# Altium schematic sheet Sheet2.SchDoc
size A4; SheetNumber: 2; SheetTotal: 6
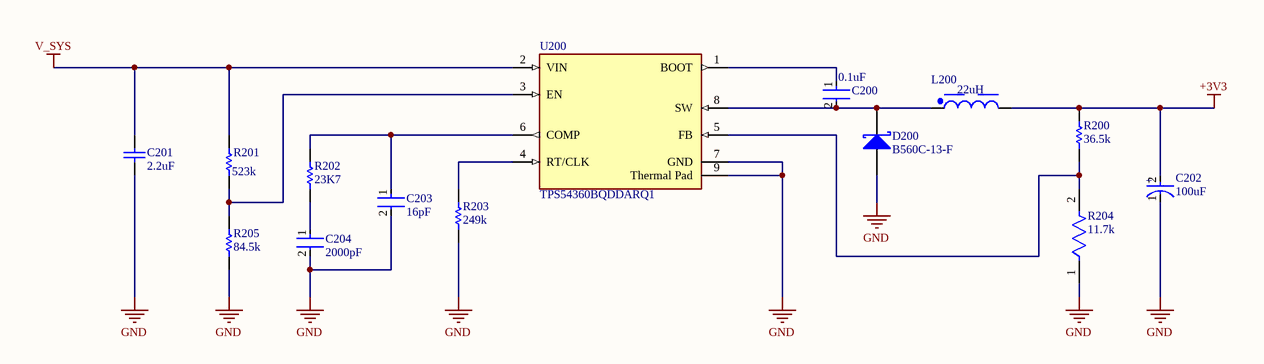
[diagram p0: Sheet2.SchDoc]

## Parts
C200  0.1uF  [FP-CC0805-0_85-MFG]
C201  2.2uF  [CAPC3225X250X20LL40]
C202  100uF  [FP-POSCAP-D2E-MFG]
C203  16pF  [FP-C0603C-CF-MFG]
C204  2000pF  [FP-C0805C-DN-MFG]
D200  B560C-13-F  [DIOD-B5X0C-2_M]
L200  22uH  [WE-TI_8095]
R200  36.5k  [RESC0603X28X15ML05T05]
R201  523k  [RESC1005X40X25NL05T10]
R202  23K7  [RESC0201(0603)_M]
R203  249k  [RESC0603X28X15LL05T05]
R204  11.7k  [FP-RT0805-MFG]
R205  84.5k  [RESC1005X40X25ML05T10]
U200  TPS54360BQDDARQ1  [FP-DDA0008E-MFG]

## Nets
+3V3: C202.2(A) L200.2 R200.2
GND: C201.1 C202.1(C) C203.2 C204.2 D200.2(A) R203.1 R204.1 R205.1 U200.7(GND) U200.9(Thermal_Pad)
V_SYS: C201.2 R201.2 U200.2(VIN)
NetC200_1: C200.1 U200.1(BOOT)
NetC200_2: C200.2 D200.1(K) L200.1 U200.8(SW)
NetC203_1: C203.1 R202.2 U200.6(COMP)
NetC204_1: C204.1 R202.1
NetR200_1: R200.1 R204.2 U200.5(FB)
NetR201_1: R201.1 R205.2 U200.3(EN)
NetR203_2: R203.2 U200.4(RT/CLK)

## Notes on the sheet
- (in symbol CMP-05428-001405-1) +

## Library data of the parts
C200 = CMP-2100-03606-3: CAP CER 0.1UF 50V X7R 0805; Manufacturer Part Number: CC0805KRX7R9BB104; Manufacturer: Yageo; Tolerance: 0.1; Capacitance: 100 nF; Value: 100 nF; Material: Ceramic; Device Class L1: Passive Components; ComponentLink2Description: Datasheet; Package: CC0805-0.85; Digikey Description: CAP CER 0.1UF 50V X7R 0805; Device Class L3: Ceramic Capacitors; Temperature: -30°C to +85°C; Temperature Characteristic: X7R; Voltage Rating: 50 V; Height: 0.95mm; RoHS: TRUE; Ipc Land Pattern Name: CAPC200125X85; Device Class L2: Capacitors; Category: Cap; Temperature Range Low: -30°C; Temperature Range High: +85°C; Mouser Description: Multilayer Ceramic Capacitors MLCC - SMD/SMT 100nF 50V X7R 10%; Footprint Url: http://www.yageo.com/exep/pages/download/literatures/UPY-C_GEN_24.pdf; Automotive: No; Octopart: https://octopart.com/cc0805krx7r9bb104-yageo-192993; Lead Free: Yes; ComponentLink2URL: http://www.yageo.com/documents/recent/UPY-GPHC_Y5V_6.3V-to-50V_8.pdf
C201 = CMP-2000-06053-1: Chip Capacitor, 2.2 uF, +/- 10%, -55 to 125 degC, 1210 (3225 Metric), RoHS, Tape and Reel; PCN Part Number: MLCCPartNumberChange30/Nov/2012; Manufacturer: TDK; Capacitance: 2.2µF; Catalog Drawings: CSERIES_1210_2.5; Product Training Modules: SEAT,CCV,andTVCLDesignToolsGuidetoReplacinganElectrolyticCapacitorwithanMLCC; Other Names: 445-4497-6; Voltage - Rated: 100V; Temperature Coefficient: X7R; Featured Product: C-SeriesMidVoltageMLCCs; Online Catalog: CSeries,MidVoltage; Ratings: -; Mounting Technology: SurfaceMount; Height - Seated (Max): -; Applications: GeneralPurpose; Packaging: Digi-Reel®; Mounting Type: SurfaceMount,MLCC; Lead Spacing: -; Thickness (Max): 0.098"(2.50mm); Package Reference: 1210 (3225 Metric); Manufacturer URL: http://www.tdk.com/; Size / Dimension: 0.126"Lx0.098"W(3.20mmx2.50mm); Operating Temperature: -55°C~125°C; Datasheet URL: https://datasheet.ciiva.com/15192/getdatasheetpartid-725361-15192330.pdf; RoHS Information: RoHSCertificate-MLCC; Lead Style: -; Standard Package: 1; Family: CeramicCapacitors; Datasheet Version: 10/2014; Category: Capacitors; Tolerance: ±10%; Features: -; Series: C; Package Description: 2-Pin Surface Mount Device, Body 3.2 x 2.5 mm; Package / Case: 1210(3225Metric)
C202 = CMP-05428-001405-1: Molded Tantalum Polymer Capacitor 100uF 20% 6.3V life 2000Hours SMD 2917; ESR (Equivalent Series Resistance): 18mR; Polarity: Polar; Ripple Current: 2.8A; Leakage Current: 63uA; Dissipation Factor: 10%; Width: 4.3mm; Tolerance: 20%; Material: Polymer; Case/Package: 2917; Voltage Rating (DC): 6.3V; Capacitance: 100uF; Case Code (Metric): 7343; Features: General Purpose; Package Quantity: 3000; Voltage: 6.3V; Lead Free: Lead Free; Voltage Rating: 6.3V; Length: 7.3mm; Construction: Flat; RoHS Compliant: Yes; Height - Seated (Max): 0.079inch; Series: POSCAP™ TPE; Radiation Hardening: No; Case Code (Imperial): 2917; REACH SVHC: No SVHC; Max Operating Temperature: 105°C; Mount: Surface Mount; Depth: 4.3mm; Height: 1.8mm; Min Operating Temperature: -55°C; Packaging: Tape and Reel; Termination: SMD/SMT
C203 = CMP-1035-00716-3: CAP CER 16PF 50V 5% NP0 0603; Manufacturer Part Number: C0603C160J5GACTU; Manufacturer: KEMET; Automotive Grade: Grade 1; Material: Ceramic; Temperature Coefficient: 30ppm/°C; Tolerance: 0.05; Temperature Characteristic: C0G; Octopart: https://octopart.com/c0603c160j5gactu-kemet-9143816; ComponentLink2URL: https://api.kemet.com/component-edge/download/datasheet/C0603C100J5GACAUTO.pdf; Category: Cap; Mouser Description: Multilayer Ceramic Capacitors MLCC - SMD/SMT 50volts 16pF C0G 5%; Device Class L1: Passive Components; Capacitance: 16 pF; Voltage Rating: 50 V; Temperature Range Low: -55°C; Automotive: Yes; Device Class L3: Ceramic Capacitors; Package: C0603C-CF; Temperature Range High: +125°C; Digikey Description: CAP CER 16PF 50V 5% NP0 0603; Value: 16 pF; Lead Free: Yes; Height: 0.87mm; Device Class L2: Capacitors; Temperature: -55°C to +125°C; ComponentLink2Description: Datasheet; RoHS: TRUE
C204 = CMP-1036-03225-3: CAP CER 2000PF 25V 5% NP0 0805; Manufacturer Part Number: C0805C202J3GACTU; Manufacturer: KEMET; Value: 2,000 pF; Material: Ceramic; Temperature Characteristic: C0G; Temperature Coefficient: 30ppm/°C; Tolerance: 0.05; Package: C0805C-DN; Category: Cap; ComponentLink2URL: https://content.kemet.com/datasheets/KEM_C1003_C0G_SMD.pdf; ComponentLink2Description: Datasheet; Device Class L3: Ceramic Capacitors; Device Class L1: Passive Components; Octopart: https://octopart.com/c0805c202j3gactu-kemet-11998870; Voltage Rating: 25 V; Height: 0.88mm; Ipc Land Pattern Name: CAPC200125X78; Temperature: -55°C to +125°C; Capacitance: 2,000 pF; Lead Free: Yes; Automotive: No; Temperature Range High: +125°C; Temperature Range Low: -55°C; Mouser Description: Cap Ceramic 0.002uF 25V C0G 5% SMD 0805 125°C Paper T/R; RoHS: TRUE; Digikey Description: CAP CER 2000PF 25V 5% NP0 0805; Device Class L2: Capacitors
D200 = CMP-2000-05098-2: Schottky Barrier Rectifier, 5 A, 60 V, -55 to 125 degC, 2-Pin SMD, RoHS, Tape and Reel; Ir - Reverse Current: 500uA; Configuration: Single; Ifsm - Forward Surge Current: 100A; Vrrm - Repetitive Reverse Voltage: 60V; Brand: DiodesIncorporated; Vf - Forward Voltage: 0.7V; If - Forward Current: 5A; Unit Weight: 0.007408oz; Type: SchottkyBarrierRectifier; Package / Case: SMC; Manufacturer URL: http://www.diodes.com/; Datasheet URL: https://datasheet.ciiva.com/27052/1538961-27052355.pdf; Factory Pack Quantity: 3000; Height: 2.5mm; Width: 6.22mm; Product Category: SchottkyDiodes&Rectifiers; Minimum Operating Temperature: -55C; Manufacturer: DiodesIncorporated; Datasheet Version: Rev. 7-2, 06/2007; Product: SchottkyDiodes; Maximum Operating Temperature: +125C; Operating Temperature Range: -55Cto+125C; Technology: Si; Length: 7.11mm; RoHS: True; Packaging: Reel; Termination Style: SMD/SMT; Series: B560; Mounting Style: SMD/SMT
L200 = CMP-03913-110288128-3: Inductor, 22Uh, Unshielded, 3A, Rad Rohs Compliant: Yes; Inductance: 22µH; Voltage Rating: 80V; DC Resistance (DCR): 46mΩ; Ambient Temperature Range High: 85°C; Ambient Temperature Range Low: -40°C; Current Rating: 3A; RoHS: Compliant; Max Operating Temperature: 125°C; Min Operating Temperature: -40°C; Length: 7.8mm; Width: 7.8mm; Height: 9.5mm
R200 = CMP-2004-00521-1: 100mW Thick Film Resistors 75V ±1% ±100ppm/℃ 36.5kΩ 0603 Chip Resistor - Surface; Manufacturer: Vishay Dale; Part Number: CRCW020136K5FNED
R201 = CMP-2002-07734-1: RES 523K OHM 1% 1/16W 0402; Part Number: RC0402FR-07523KL; Manufacturer: Yageo / Phycomp
R202 = CMP-1010-00569-1: 23K7 0.05W 1% 0201 (0603 Metric)  SMD; Case-Metric: 0603; Case-EIA: 0201; Value: 23700.00 Ohm; Power: 0.05 W; Tolerance: 1 %; Technology: SMT
R203 = CMP-1010-00685-2: Res Thick Film 0603 2.2K Ohm 1% 0.1W(1/10W) ±100ppm/C SMD AutomoTEXASve T/R; Part Number: CRCW0201249KFKED; Manufacturer: Vishay Dale
R204 = CMP-03412-011069-1: RES 11.7K OHM 0.1% 1/8W 0805; Manufacturer: Yageo; Manufacturer Part Number: RT0805BRD0711K7L; Resistance: 11.7kΩ; Voltage Rating: 150V; Value: 11.7kΩ; Temperature Coefficient: 25ppm/°C; Power Rating: 0.125W; RoHS: TRUE; Composition: Thin Film; Height: 0.6mm; Automotive: No; Tolerance: 0.1%; Package: RT0805; Device Class L2: Resistors; Footprint Url: http://www.yageo.com/exep/pages/download/literatures/PYu-R_Mount_10.pdf; ComponentLink2Description: Datasheet; Device Class L1: Passive Components; Temperature Range High: +155°C; Device Class L3: Chip SMD Resistors; Temperature Range Low: -55°C; Lead Free: Yes; ComponentLink2URL: http://www.yageo.com/documents/recent/PYu-RT_1-to-0.01_RoHS_L_9.pdf; Octopart: https://octopart.com/rt0805brd0711k7l-yageo-78404094; Ipc Land Pattern Name: RESC200125X50; Series: RT; Mouser Description: High Precision-High Stability Chip Resistor Thin Film 0805 11.7kOhm 0.1% Paper T/R; Temperature: -55°C to +155°C; Category: Res; Digikey Description: RES 11.7K OHM 0.1% 1/8W 0805
R205 = CMP-2002-07822-1: RES 84.5K OHM 1% 1/16W 0402; Manufacturer: Yageo / Phycomp; Part Number: RC0402FR-0784K5L
U200 = CMP-04918-000007-1: IC REG BCK SPLIT RAIL ADJ 8SOPWR; Manufacturer: Texas Instruments; Switching Topology: Buck; Max Junction Temp: +150°C; Max Supply Voltage: 60V; Number Of Outputs: 1; Min Supply Voltage: 4.5V; Output Voltage: 0.8-58.8V; Output Type: AdjustableProgrammable; Output Current: 3.5A; Max Duty Cycle: 98%; Nominal Supply Current: 146uA; Automotive Grade: Grade 1; Switching Frequency: 100-2500kHz; Standoff Height: 0mm; Automotive: Yes; RoHS: TRUE; Category: IC; Temperature Range Low: -40°C; Ambient Temperature Range Low: -40°C; Digikey Description: IC REG BCK SPLIT RAIL ADJ 8SOPWR; Lead Free: Yes; Device Class L3: Voltage Regulators - Switching; Octopart: https://octopart.com/tps54360bqddarq1-texas+instruments-80336296; ComponentLink2URL: http://www.ti.com/lit/ds/symlink/tps54360b-q1.pdf; Temperature Range High: +125°C; Temperature: -40°C to +125°C; Ambient Temperature Range High: +125°C; Device Class L2: Power Management ICs; Device Class L1: Integrated Circuits (ICs); Package: DDA0008E; Height: 1.7mm; Manufacturer Part Number: TPS54360BQDDARQ1; ComponentLink2Description: Datasheet